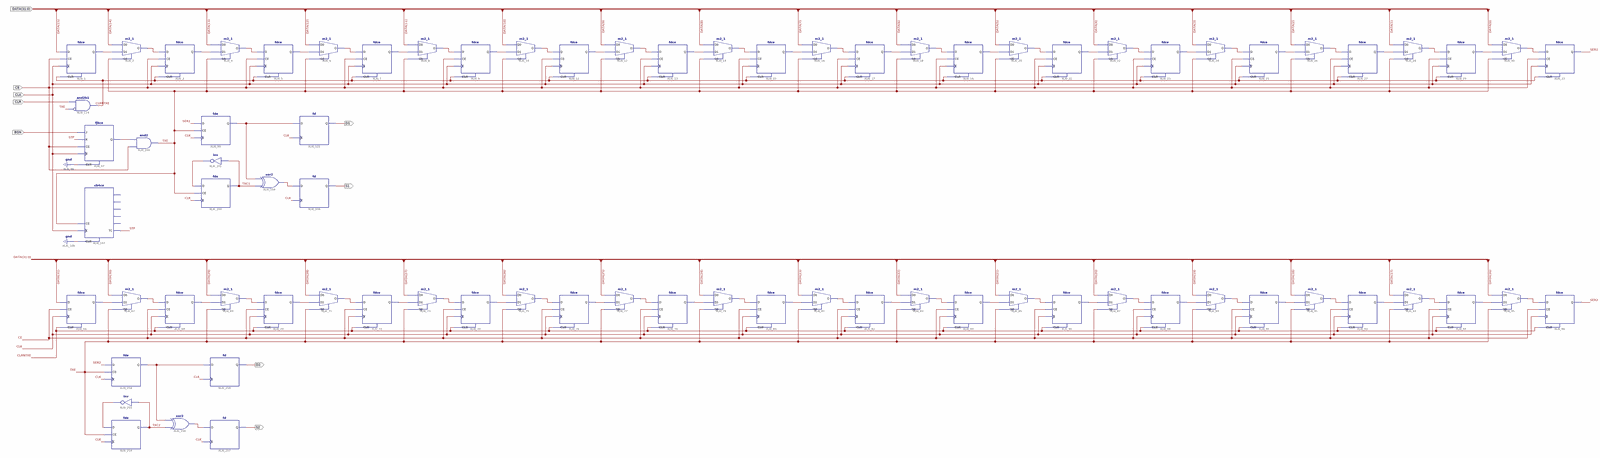
[diagram p0: schematic sheet 1, whole]
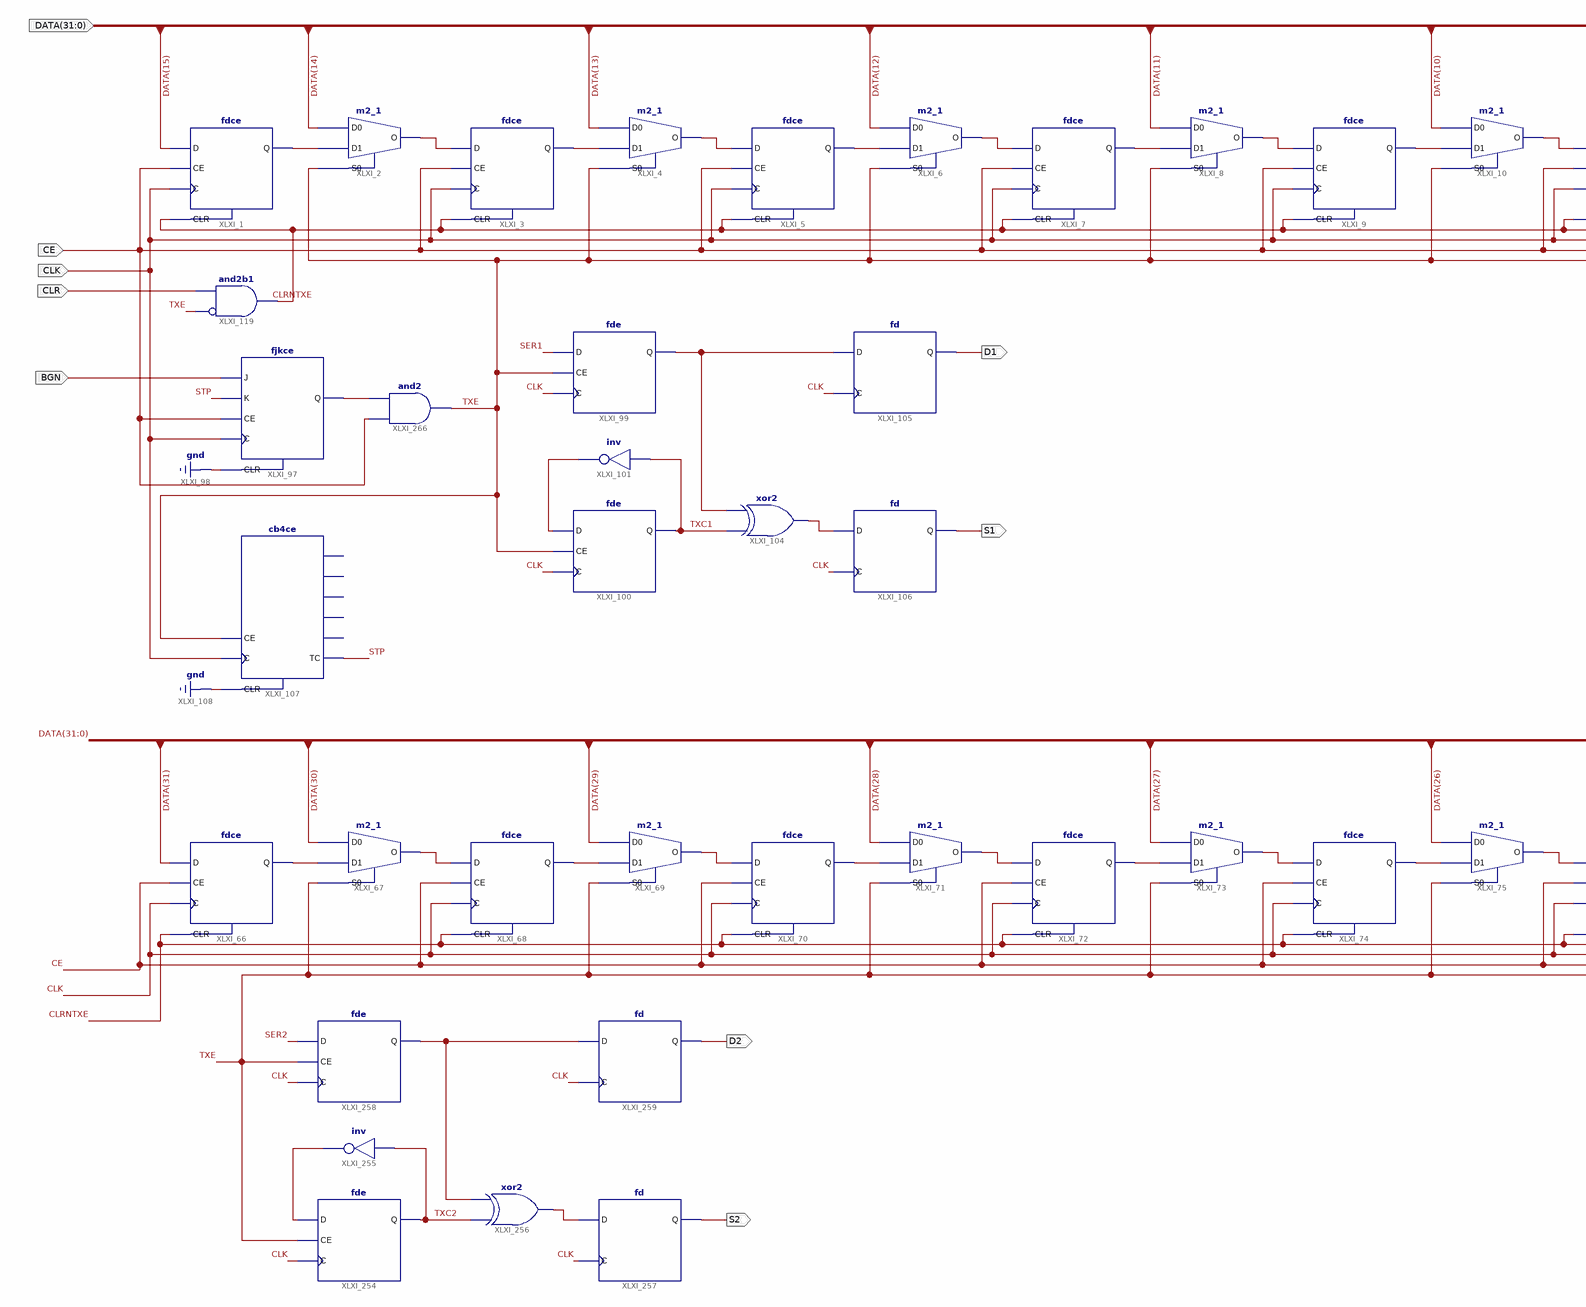
[diagram p1: schematic sheet 1, left part]
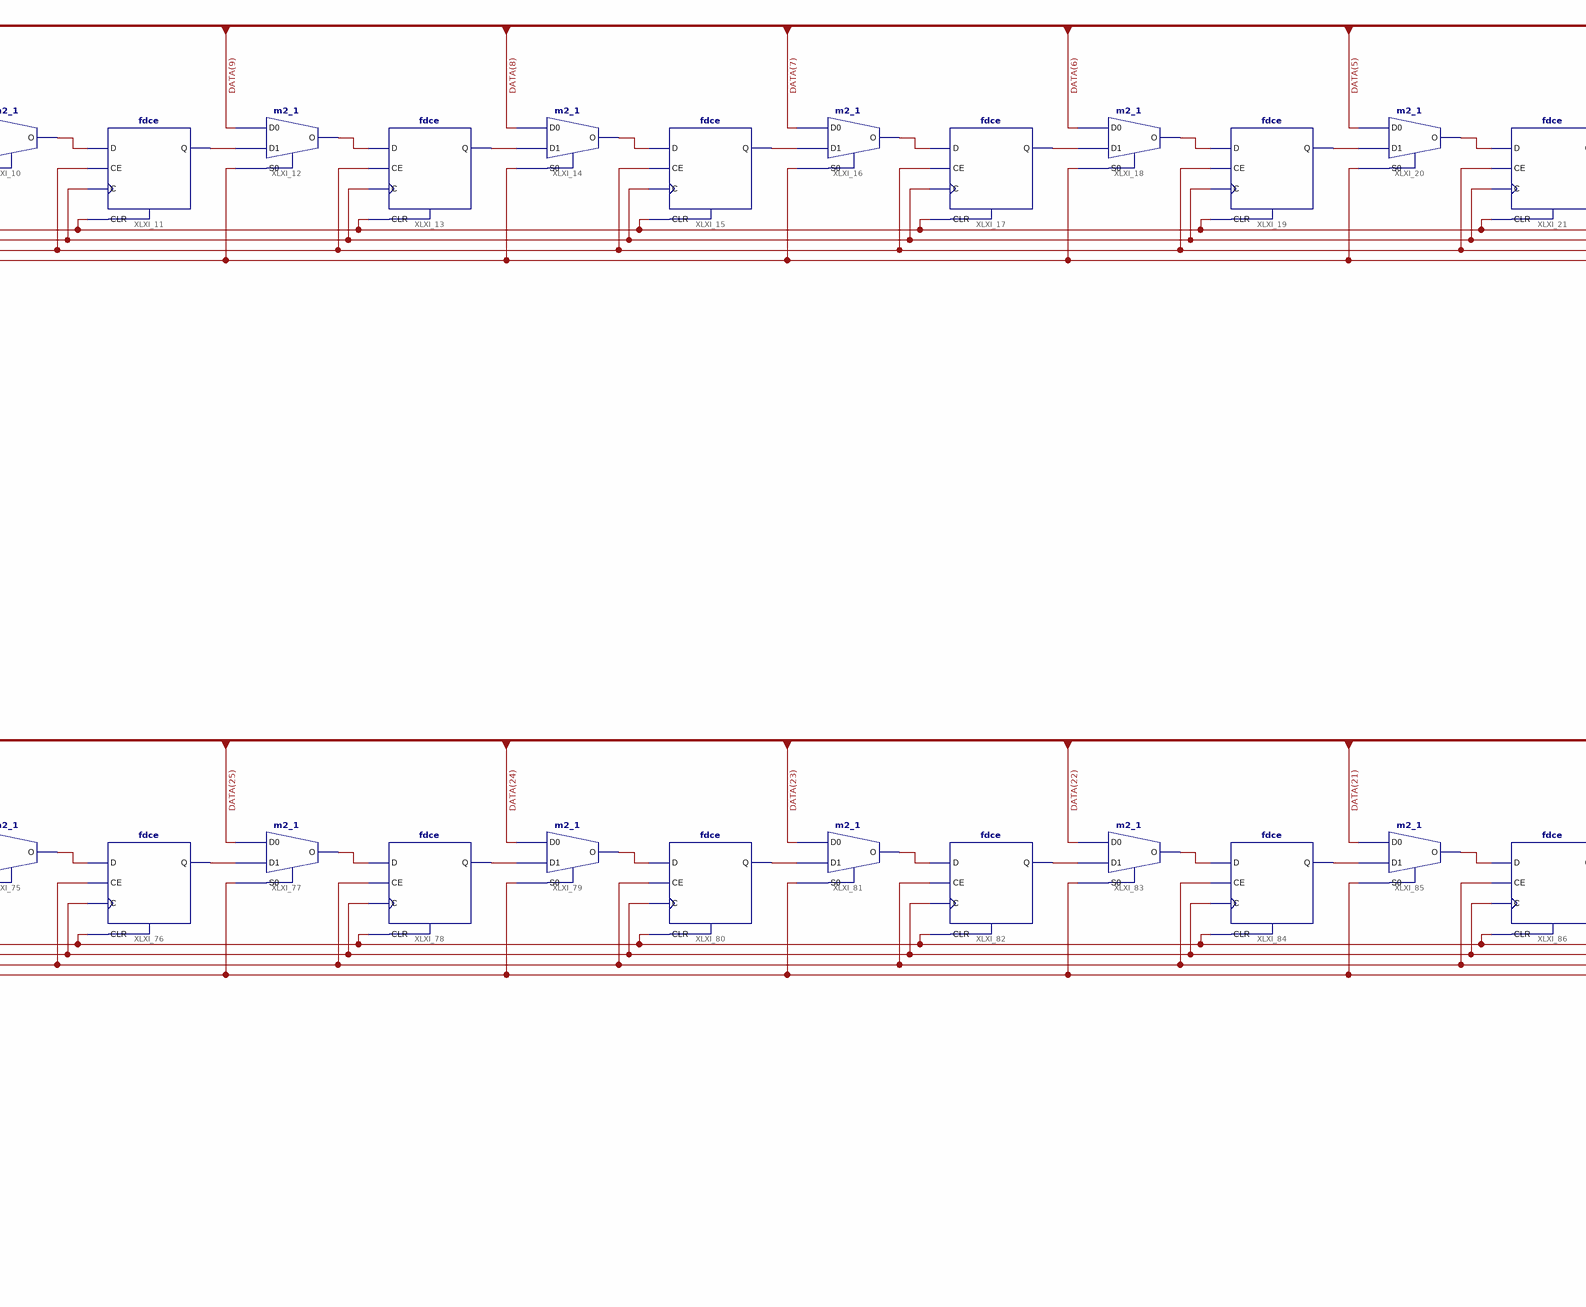
[diagram p2: schematic sheet 1, centre part]
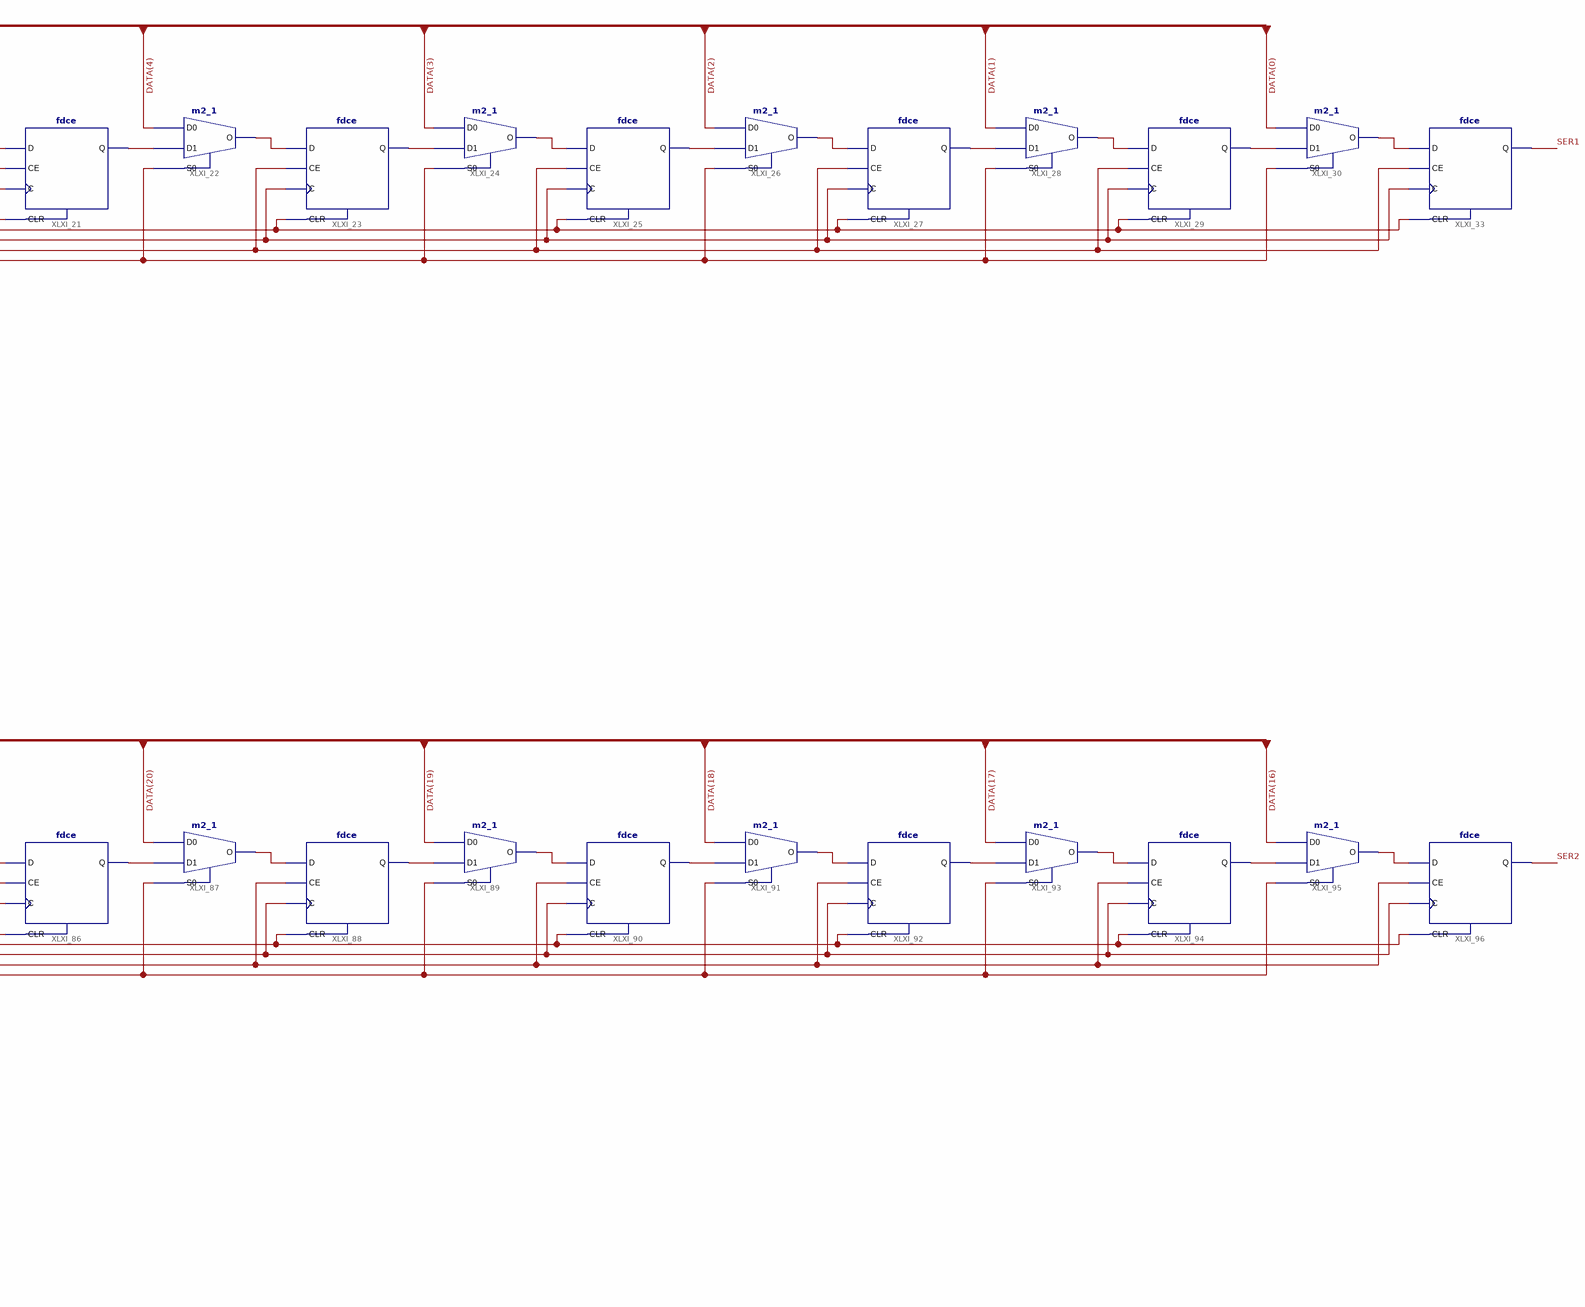
[diagram p3: schematic sheet 1, right part]
// Xilinx ISE schematic spacewire_tx_x2.sch (spartan6) as structural Verilog: 78 symbols, 9 ports
module spacewire_tx_x2 (
  input  [31:0] DATA,
  input  CLK,
  input  CE,
  input  CLR,
  input  BGN,
  output S2,
  output D2,
  output S1,
  output D1
);

  wire CLRNTXE, SER1, SER2, STP, TXC1, TXC2, TXE, XLXN_1, XLXN_2, XLXN_3, XLXN_14, XLXN_15, XLXN_19, XLXN_20,
       XLXN_24, XLXN_25, XLXN_29, XLXN_30, XLXN_34, XLXN_35, XLXN_39, XLXN_40, XLXN_44, XLXN_45, XLXN_49,
       XLXN_50, XLXN_54, XLXN_55, XLXN_59, XLXN_60, XLXN_64, XLXN_65, XLXN_69, XLXN_70, XLXN_74, XLXN_75,
       XLXN_89, XLXN_190, XLXN_191, XLXN_192, XLXN_197, XLXN_198, XLXN_200, XLXN_201, XLXN_203, XLXN_204,
       XLXN_206, XLXN_207, XLXN_209, XLXN_210, XLXN_212, XLXN_213, XLXN_215, XLXN_216, XLXN_218, XLXN_219,
       XLXN_221, XLXN_222, XLXN_224, XLXN_225, XLXN_227, XLXN_228, XLXN_230, XLXN_231, XLXN_233, XLXN_234,
       XLXN_236, XLXN_299, XLXN_305, XLXN_306, XLXN_764, XLXN_768, XLXN_769, XLXN_788;

  m2_1 XLXI_2 (.D0(DATA[14]), .D1(XLXN_1), .S0(TXE), .O(XLXN_3));
  fdce XLXI_3 (.C(CLK), .CE(CE), .CLR(CLRNTXE), .D(XLXN_3), .Q(XLXN_2));
  m2_1 XLXI_4 (.D0(DATA[13]), .D1(XLXN_2), .S0(TXE), .O(XLXN_15));
  fdce XLXI_5 (.C(CLK), .CE(CE), .CLR(CLRNTXE), .D(XLXN_15), .Q(XLXN_14));
  m2_1 XLXI_6 (.D0(DATA[12]), .D1(XLXN_14), .S0(TXE), .O(XLXN_20));
  fdce XLXI_7 (.C(CLK), .CE(CE), .CLR(CLRNTXE), .D(XLXN_20), .Q(XLXN_19));
  m2_1 XLXI_8 (.D0(DATA[11]), .D1(XLXN_19), .S0(TXE), .O(XLXN_25));
  fdce XLXI_9 (.C(CLK), .CE(CE), .CLR(CLRNTXE), .D(XLXN_25), .Q(XLXN_24));
  m2_1 XLXI_10 (.D0(DATA[10]), .D1(XLXN_24), .S0(TXE), .O(XLXN_30));
  fdce XLXI_11 (.C(CLK), .CE(CE), .CLR(CLRNTXE), .D(XLXN_30), .Q(XLXN_29));
  m2_1 XLXI_12 (.D0(DATA[9]), .D1(XLXN_29), .S0(TXE), .O(XLXN_35));
  fdce XLXI_13 (.C(CLK), .CE(CE), .CLR(CLRNTXE), .D(XLXN_35), .Q(XLXN_34));
  m2_1 XLXI_14 (.D0(DATA[8]), .D1(XLXN_34), .S0(TXE), .O(XLXN_40));
  fdce XLXI_15 (.C(CLK), .CE(CE), .CLR(CLRNTXE), .D(XLXN_40), .Q(XLXN_39));
  m2_1 XLXI_16 (.D0(DATA[7]), .D1(XLXN_39), .S0(TXE), .O(XLXN_45));
  fdce XLXI_17 (.C(CLK), .CE(CE), .CLR(CLRNTXE), .D(XLXN_45), .Q(XLXN_44));
  m2_1 XLXI_18 (.D0(DATA[6]), .D1(XLXN_44), .S0(TXE), .O(XLXN_50));
  fdce XLXI_19 (.C(CLK), .CE(CE), .CLR(CLRNTXE), .D(XLXN_50), .Q(XLXN_49));
  m2_1 XLXI_20 (.D0(DATA[5]), .D1(XLXN_49), .S0(TXE), .O(XLXN_55));
  fdce XLXI_21 (.C(CLK), .CE(CE), .CLR(CLRNTXE), .D(XLXN_55), .Q(XLXN_54));
  m2_1 XLXI_22 (.D0(DATA[4]), .D1(XLXN_54), .S0(TXE), .O(XLXN_60));
  fdce XLXI_23 (.C(CLK), .CE(CE), .CLR(CLRNTXE), .D(XLXN_60), .Q(XLXN_59));
  m2_1 XLXI_24 (.D0(DATA[3]), .D1(XLXN_59), .S0(TXE), .O(XLXN_65));
  fdce XLXI_25 (.C(CLK), .CE(CE), .CLR(CLRNTXE), .D(XLXN_65), .Q(XLXN_64));
  m2_1 XLXI_26 (.D0(DATA[2]), .D1(XLXN_64), .S0(TXE), .O(XLXN_70));
  fdce XLXI_27 (.C(CLK), .CE(CE), .CLR(CLRNTXE), .D(XLXN_70), .Q(XLXN_69));
  m2_1 XLXI_28 (.D0(DATA[1]), .D1(XLXN_69), .S0(TXE), .O(XLXN_75));
  fdce XLXI_29 (.C(CLK), .CE(CE), .CLR(CLRNTXE), .D(XLXN_75), .Q(XLXN_74));
  m2_1 XLXI_30 (.D0(DATA[0]), .D1(XLXN_74), .S0(TXE), .O(XLXN_89));
  fdce XLXI_33 (.C(CLK), .CE(CE), .CLR(CLRNTXE), .D(XLXN_89), .Q(SER1));
  fdce XLXI_1 (.C(CLK), .CE(CE), .CLR(CLRNTXE), .D(DATA[15]), .Q(XLXN_1));
  and XLXI_119 (CLRNTXE, ~TXE, CLR);  // and2b1
  cb4ce XLXI_107 (.C(CLK), .CE(TXE), .CLR(1'b0), .TC(STP));  // open: CEO, Q0, Q1, Q2, Q3
  fdce XLXI_66 (.C(CLK), .CE(CE), .CLR(CLRNTXE), .D(DATA[31]), .Q(XLXN_190));
  m2_1 XLXI_67 (.D0(DATA[30]), .D1(XLXN_190), .S0(TXE), .O(XLXN_192));
  fdce XLXI_68 (.C(CLK), .CE(CE), .CLR(CLRNTXE), .D(XLXN_192), .Q(XLXN_191));
  m2_1 XLXI_69 (.D0(DATA[29]), .D1(XLXN_191), .S0(TXE), .O(XLXN_198));
  fdce XLXI_70 (.C(CLK), .CE(CE), .CLR(CLRNTXE), .D(XLXN_198), .Q(XLXN_197));
  m2_1 XLXI_71 (.D0(DATA[28]), .D1(XLXN_197), .S0(TXE), .O(XLXN_201));
  fdce XLXI_72 (.C(CLK), .CE(CE), .CLR(CLRNTXE), .D(XLXN_201), .Q(XLXN_200));
  m2_1 XLXI_73 (.D0(DATA[27]), .D1(XLXN_200), .S0(TXE), .O(XLXN_204));
  fdce XLXI_74 (.C(CLK), .CE(CE), .CLR(CLRNTXE), .D(XLXN_204), .Q(XLXN_203));
  m2_1 XLXI_75 (.D0(DATA[26]), .D1(XLXN_203), .S0(TXE), .O(XLXN_207));
  fdce XLXI_76 (.C(CLK), .CE(CE), .CLR(CLRNTXE), .D(XLXN_207), .Q(XLXN_206));
  m2_1 XLXI_77 (.D0(DATA[25]), .D1(XLXN_206), .S0(TXE), .O(XLXN_210));
  fdce XLXI_78 (.C(CLK), .CE(CE), .CLR(CLRNTXE), .D(XLXN_210), .Q(XLXN_209));
  m2_1 XLXI_79 (.D0(DATA[24]), .D1(XLXN_209), .S0(TXE), .O(XLXN_213));
  fdce XLXI_80 (.C(CLK), .CE(CE), .CLR(CLRNTXE), .D(XLXN_213), .Q(XLXN_212));
  m2_1 XLXI_81 (.D0(DATA[23]), .D1(XLXN_212), .S0(TXE), .O(XLXN_216));
  fdce XLXI_82 (.C(CLK), .CE(CE), .CLR(CLRNTXE), .D(XLXN_216), .Q(XLXN_215));
  m2_1 XLXI_83 (.D0(DATA[22]), .D1(XLXN_215), .S0(TXE), .O(XLXN_219));
  fdce XLXI_84 (.C(CLK), .CE(CE), .CLR(CLRNTXE), .D(XLXN_219), .Q(XLXN_218));
  m2_1 XLXI_85 (.D0(DATA[21]), .D1(XLXN_218), .S0(TXE), .O(XLXN_222));
  fdce XLXI_86 (.C(CLK), .CE(CE), .CLR(CLRNTXE), .D(XLXN_222), .Q(XLXN_221));
  m2_1 XLXI_87 (.D0(DATA[20]), .D1(XLXN_221), .S0(TXE), .O(XLXN_225));
  fdce XLXI_88 (.C(CLK), .CE(CE), .CLR(CLRNTXE), .D(XLXN_225), .Q(XLXN_224));
  m2_1 XLXI_89 (.D0(DATA[19]), .D1(XLXN_224), .S0(TXE), .O(XLXN_228));
  fdce XLXI_90 (.C(CLK), .CE(CE), .CLR(CLRNTXE), .D(XLXN_228), .Q(XLXN_227));
  m2_1 XLXI_91 (.D0(DATA[18]), .D1(XLXN_227), .S0(TXE), .O(XLXN_231));
  fdce XLXI_92 (.C(CLK), .CE(CE), .CLR(CLRNTXE), .D(XLXN_231), .Q(XLXN_230));
  m2_1 XLXI_93 (.D0(DATA[17]), .D1(XLXN_230), .S0(TXE), .O(XLXN_234));
  fdce XLXI_94 (.C(CLK), .CE(CE), .CLR(CLRNTXE), .D(XLXN_234), .Q(XLXN_233));
  m2_1 XLXI_95 (.D0(DATA[16]), .D1(XLXN_233), .S0(TXE), .O(XLXN_236));
  fdce XLXI_96 (.C(CLK), .CE(CE), .CLR(CLRNTXE), .D(XLXN_236), .Q(SER2));
  fde XLXI_254 (.C(CLK), .CE(TXE), .D(XLXN_764), .Q(TXC2));
  not XLXI_255 (XLXN_764, TXC2);
  xor XLXI_256 (XLXN_769, TXC2, XLXN_768);
  fd XLXI_257 (.C(CLK), .D(XLXN_769), .Q(S2));
  fde XLXI_258 (.C(CLK), .CE(TXE), .D(SER2), .Q(XLXN_768));
  fd XLXI_259 (.C(CLK), .D(XLXN_768), .Q(D2));
  fjkce XLXI_97 (.C(CLK), .CE(CE), .CLR(1'b0), .J(BGN), .K(STP), .Q(XLXN_788));
  fde XLXI_100 (.C(CLK), .CE(TXE), .D(XLXN_299), .Q(TXC1));
  not XLXI_101 (XLXN_299, TXC1);
  xor XLXI_104 (XLXN_306, TXC1, XLXN_305);
  fd XLXI_106 (.C(CLK), .D(XLXN_306), .Q(S1));
  fde XLXI_99 (.C(CLK), .CE(TXE), .D(SER1), .Q(XLXN_305));
  fd XLXI_105 (.C(CLK), .D(XLXN_305), .Q(D1));
  and XLXI_266 (TXE, CE, XLXN_788);
endmodule
